# EasyEDA Pro project grandPA2.eprj, schematic peripherals
Board Name: peripherals; Create Date: 2026-07-16; Page Name: P1; Project Name: grandPA2; Schematic Name: peripherals; Update Date: 2026-07-17; Company: EasyEDA.com; Page Size: A4; Version: v0.2
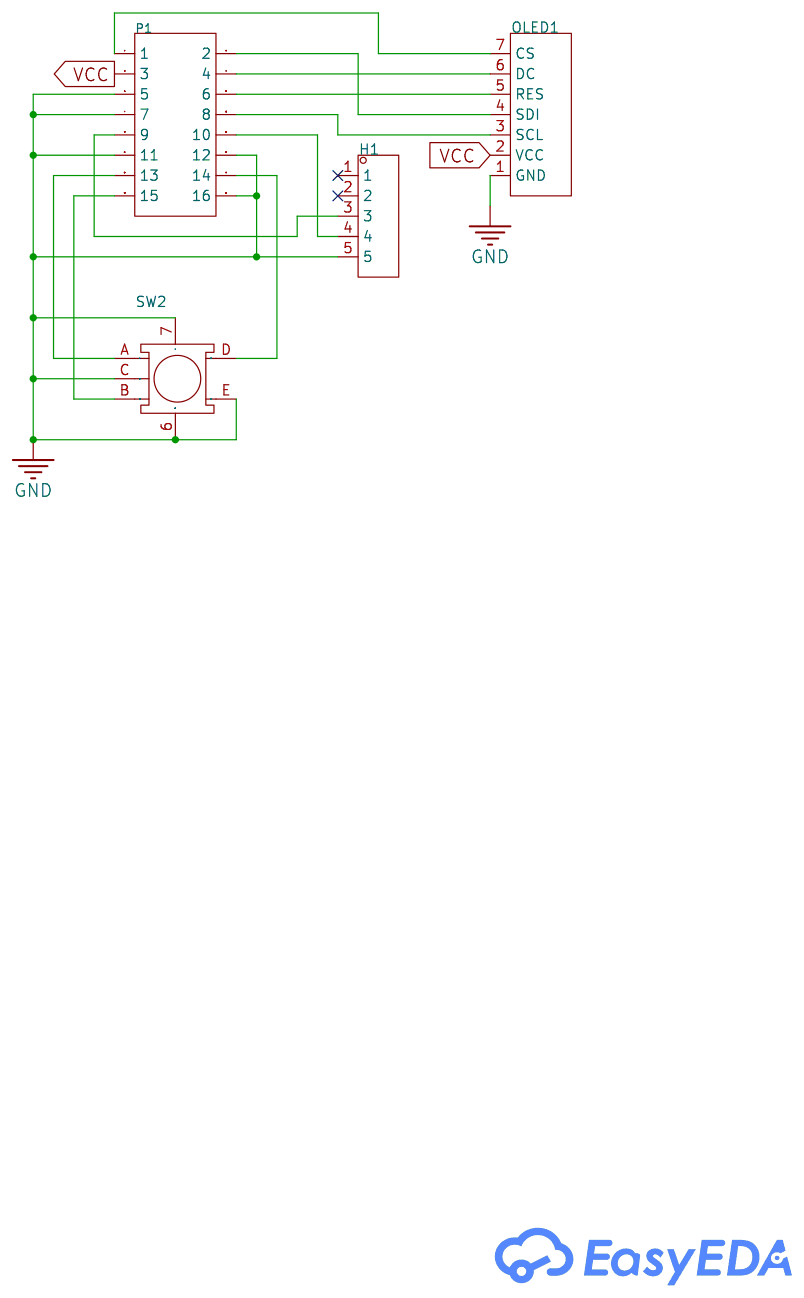
[diagram p3: schematic sheet]

## Parts
H1  -  [HDR-TH_5P-P2.54-V-M]
OLED1  HS13L02W4S01  [OLED-TH_HS13L02W4S01]
P1  2.54-2*8P简牛  [IDC-TH_16P-P2.54_C3406]
SW2  -  [SW-TH_EC11XXXXXXXX]

## Library data of the parts
H1 = HDR-M_2.54_1x5P: Supplier Footprint: Through
OLED1 = HS13L02W4S01: LCSC Part Name: OLED显示模块; Supplier Part: C42432558; Manufacturer: HS(汉昇); Datasheet: https://item.szlcsc.com/datasheet/HS13L02W4S01/44461019.html; Supplier: LCSC; Controller Type: SH1106 chip; Size: 1.3; Dot Pixels: 128x64; Operating Temperature: -40℃~+80℃; Type of Drive: Passive (PMOLED); Display Range: 29.42x14.7mm; Display Color: White; Luminance: 150cd/m2
P1 = 2.54-2*8P简牛: LCSC Part Name: 2.54mm 2x8P 排数:2 每排P数:8; Supplier Part: C3406; Manufacturer: BOOMELE(博穆精密); Supplier Footprint: 插件,P=2.54mm; JLCPCB Part Class: Extended Part; Datasheet: https://item.szlcsc.com/datasheet/2.54-2*8P%25E7%25AE%2580%25E7%2589%259B/3807.html; Supplier: LCSC; Connector Type: IDC Header; Pitch: 2.54mm; Number of Positions or Pins: 2x8P; Current Rating: 1A; Holder Type: Through Hole; Row Spacing: 2.54mm; Number of Rows: 2; Number of PINs Per Row: 8; Contact Material: Brass; Contact Plating: Gold; Operating Temperature: -55℃~+105℃; Color: Black
SW2 = EC11E15244B2: Supplier Footprint: Through

## Nets
GND: H1.5 OLED1.1(GND) P1.5 P1.7 P1.11 P1.12 P1.16 SW2.6 SW2.7 SW2.C SW2.E
VCC: OLED1.2(VCC) P1.3
$1N1183: OLED1.4(SDI) P1.2
$1N2859: OLED1.3(SCL) P1.8
$1N2908: OLED1.5(RES) P1.6
$1N2911: OLED1.6(DC) P1.4
$1N2932: OLED1.7(CS) P1.1
$1N2949: H1.4 P1.10
$1N2960: H1.3 P1.9
$1N3145: P1.14 SW2.D
$1N3518: P1.15 SW2.B
$1N3527: P1.13 SW2.A

Not connected (* = marked no-connect by the designer): H1 1* 2*
